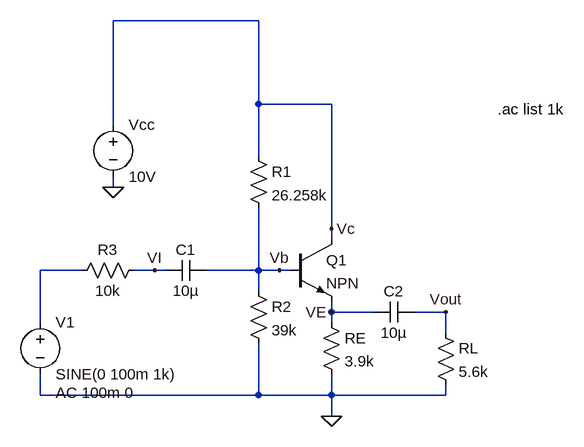
[diagram p0: schematic Common_Emitter_Rin_Value, Av.asc]
Common_Emitter_Rin_Value, Av.asc, the LTspice schematic file:
Version 4
SHEET 1 880 680
WIRE 208 -176 -16 -176
WIRE 208 -48 208 -176
WIRE 320 -48 208 -48
WIRE -16 -16 -16 -176
WIRE 208 32 208 -48
WIRE -16 80 -16 64
WIRE 320 144 320 -48
WIRE 320 160 320 144
WIRE -64 208 -128 208
WIRE 48 208 16 208
WIRE 64 208 48 208
WIRE 208 208 208 112
WIRE 208 208 128 208
WIRE 240 208 208 208
WIRE 256 208 240 208
WIRE 208 240 208 208
WIRE 320 272 320 256
WIRE 384 272 320 272
WIRE 496 272 448 272
WIRE -128 288 -128 208
WIRE 320 288 320 272
WIRE 496 304 496 272
WIRE -128 400 -128 368
WIRE 208 400 208 320
WIRE 208 400 -128 400
WIRE 320 400 320 368
WIRE 320 400 208 400
WIRE 496 400 496 384
WIRE 496 400 320 400
WIRE 320 432 320 400
FLAG -16 80 0
FLAG 320 272 VE
FLAG 320 144 Vc
FLAG 320 432 0
FLAG 496 272 Vout
FLAG 48 208 VI
FLAG 240 208 Vb
SYMBOL voltage -16 -32 R0
WINDOW 123 0 0 Left 0
WINDOW 39 0 0 Left 0
SYMATTR InstName Vcc
SYMATTR Value 10V
SYMBOL res 192 16 R0
WINDOW 0 36 40 Left 2
WINDOW 3 36 76 Left 2
SYMATTR InstName R1
SYMATTR Value 26.258k
SYMBOL res 192 224 R0
WINDOW 0 36 40 Left 2
WINDOW 3 36 76 Left 2
SYMATTR InstName R2
SYMATTR Value 39k
SYMBOL res 304 272 R0
WINDOW 0 36 40 Left 2
WINDOW 3 36 76 Left 2
SYMATTR InstName RE
SYMATTR Value 3.9k
SYMBOL res 480 288 R0
WINDOW 0 36 40 Left 2
WINDOW 3 36 76 Left 2
SYMATTR InstName RL
SYMATTR Value 5.6k
SYMBOL voltage -128 272 R0
WINDOW 123 24 124 Left 2
WINDOW 39 0 0 Left 0
SYMATTR Value2 AC 100m 0
SYMATTR InstName V1
SYMATTR Value SINE(0 100m 1k)
SYMBOL res 32 192 R90
WINDOW 0 0 56 VBottom 2
WINDOW 3 32 56 VTop 2
SYMATTR InstName R3
SYMATTR Value 10k
SYMBOL cap 128 192 R90
WINDOW 0 0 32 VBottom 2
WINDOW 3 32 32 VTop 2
SYMATTR InstName C1
SYMATTR Value 10µ
SYMBOL cap 448 256 R90
WINDOW 0 0 32 VBottom 2
WINDOW 3 32 32 VTop 2
SYMATTR InstName C2
SYMATTR Value 10µ
SYMBOL npn 256 160 R0
WINDOW 0 56 32 Left 2
WINDOW 3 56 68 Left 2
SYMATTR InstName Q1
TEXT 576 -40 Left 2 !.ac list 1k

The netlist it stands for:
* Common_Emitter_Rin_Value, Av.asc
Vcc Vc 0 10V
R1 Vc Vb 26.258k
R2 Vb 0 39k
RE VE 0 3.9k
RL Vout 0 5.6k
V1 N001 0 SINE(0 100m 1k) AC 100m 0
R3 VI N001 10k
C1 Vb VI 10µ
C2 Vout VE 10µ
Q1 Vc Vb VE 0 NPN
.model NPN NPN
.model PNP PNP
.lib standard.bjt
.ac list 1k
.backanno
.end